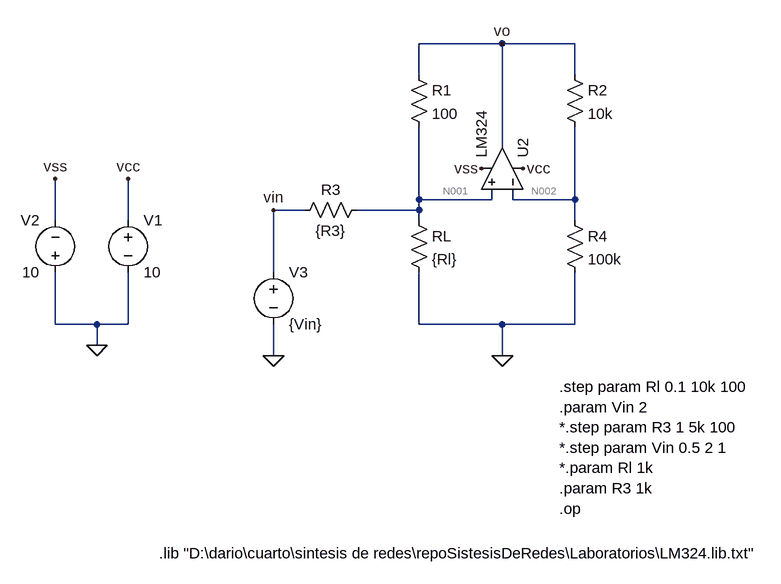
[diagram p0: schematic fuenteDeCorriente.asc]
fuenteDeCorriente.asc, the LTspice schematic file:
Version 4
SHEET 1 1408 680
WIRE 256 -176 128 -176
WIRE 368 -176 256 -176
WIRE 128 -128 128 -176
WIRE 368 -128 368 -176
WIRE 256 -16 256 -176
WIRE 128 64 128 -48
WIRE 240 64 240 48
WIRE 240 64 128 64
WIRE 272 64 272 48
WIRE 368 64 368 -48
WIRE 368 64 272 64
WIRE -48 80 -96 80
WIRE 128 80 128 64
WIRE 128 80 32 80
WIRE -432 96 -432 32
WIRE -320 96 -320 32
WIRE 128 96 128 80
WIRE 368 96 368 64
WIRE -96 176 -96 80
WIRE -432 256 -432 176
WIRE -368 256 -432 256
WIRE -320 256 -320 176
WIRE -320 256 -368 256
WIRE 128 256 128 176
WIRE 256 256 128 256
WIRE 368 256 368 176
WIRE 368 256 256 256
WIRE -368 288 -368 256
WIRE -96 304 -96 256
WIRE 256 304 256 256
FLAG -368 288 0
FLAG -320 32 vcc
FLAG -432 32 vss
FLAG -96 304 0
FLAG 256 -176 vo
FLAG 256 304 0
FLAG -96 80 vin
FLAG 288 16 vcc
FLAG 224 16 vss
SYMBOL voltage -320 80 R0
WINDOW 123 0 0 Left 0
WINDOW 39 0 0 Left 0
SYMATTR InstName V1
SYMATTR Value 10
SYMBOL voltage -432 192 R180
WINDOW 0 24 96 Left 2
WINDOW 3 24 16 Left 2
WINDOW 123 0 0 Left 0
WINDOW 39 0 0 Left 0
SYMATTR InstName V2
SYMATTR Value 10
SYMBOL voltage -96 160 R0
WINDOW 123 0 0 Left 0
WINDOW 39 0 0 Left 0
SYMATTR InstName V3
SYMATTR Value {Vin}
SYMBOL res 352 -144 R0
SYMATTR InstName R2
SYMATTR Value 10k
SYMBOL res 112 -144 R0
SYMATTR InstName R1
SYMATTR Value 100
SYMBOL res 352 80 R0
SYMATTR InstName R4
SYMATTR Value 100k
SYMBOL res 112 80 R0
SYMATTR InstName RL
SYMATTR Value {Rl}
SYMBOL res 48 64 R90
WINDOW 0 0 56 VBottom 2
WINDOW 3 32 56 VTop 2
SYMATTR InstName R3
SYMATTR Value {R3}
SYMBOL Opamps\\opamp2 320 16 M270
SYMATTR InstName U2
SYMATTR Value LM324
TEXT -272 608 Left 2 !.lib "D:\\dario\\cuarto\\sintesis de redes\\repoSistesisDeRedes\\Laboratorios\\LM324.lib.txt"
TEXT 344 352 Left 2 !.step param Rl 0.1 10k 100\n.param Vin 2\n*.step param R3 1 5k 100\n*.step param Vin 0.5 2 1\n*.param Rl 1k\n.param R3 1k\n.op

The netlist it stands for:
* fuenteDeCorriente.asc
V1 vcc 0 10
V2 0 vss 10
V3 vin 0 {Vin}
R2 vo N002 10k
R1 vo N001 100
R4 N002 0 100k
RL N001 0 {Rl}
R3 N001 vin {R3}
XU2 N001 N002 vcc vss vo LM324  ; pins In+ In- V+ V- OUT
.lib "D:\dario\cuarto\sintesis de redes\repoSistesisDeRedes\Laboratorios\LM324.lib.txt"
.step param Rl 0.1 10k 100
.param Vin 2
*.step param R3 1 5k 100
*.step param Vin 0.5 2 1
*.param Rl 1k
.param R3 1k
.op
.backanno
.end

* Results of the author's LTspice run, read from the files saved beside the schematic
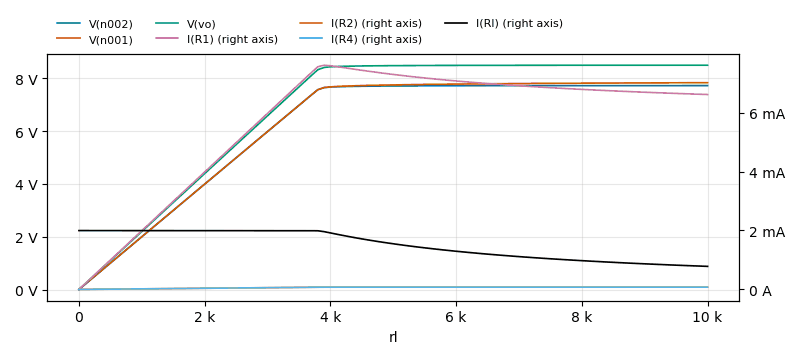
[diagram p1: Operating Point of fuenteDeCorriente.asc, plotted from the saved traces]
* Operating Point, 1 run:
*   V(n002): 166.1 µV at rl=100 m, 7.721 V at rl=10 k, min 166.1 µV, max 7.721 V
*   V(n001): 199.8 µV at rl=100 m, 7.831 V at rl=10 k, min 199.8 µV, max 7.831 V
*   V(vo): -16.68 µV at rl=100 m, 8.492 V at rl=10 k, min -16.68 µV, max 8.492 V
*   I(R1): -2.164 µA at rl=100 m, 6.614 mA at rl=10 k, min -2.164 µA, max 7.608 mA
*   I(R2): -18.28 nA at rl=100 m, 77.17 µA at rl=10 k, min -18.28 nA, max 77.17 µA
*   I(R4): 1.661 nA at rl=100 m, 77.21 µA at rl=10 k, min 1.661 nA, max 77.21 µA
*   I(Rl): 1.998 mA at rl=100 m, 783.1 µA at rl=10 k, min 783.1 µA, max 1.998 mA